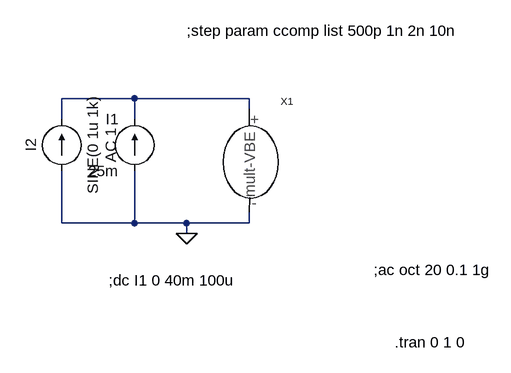
[diagram p0: schematic mult-vbe.asc]
mult-vbe.asc, the LTspice schematic file:
Version 4
SHEET 1 880 680
WIRE -80 32 -192 32
WIRE 96 32 -80 32
WIRE 96 48 96 32
WIRE -192 64 -192 32
WIRE -80 64 -80 32
WIRE -192 224 -192 144
WIRE -80 224 -80 144
WIRE -80 224 -192 224
WIRE 0 224 -80 224
WIRE 96 224 96 208
WIRE 96 224 0 224
WIRE 0 240 0 224
FLAG 0 240 0
SYMBOL current -80 144 R180
WINDOW 0 24 80 Left 2
WINDOW 3 24 0 Left 2
WINDOW 123 0 0 Left 2
WINDOW 39 0 0 Left 2
SYMATTR InstName I1
SYMATTR Value 25m
SYMBOL ss-mult-vbe 96 112 R0
SYMATTR InstName X1
SYMBOL current -192 144 R180
WINDOW 0 32 40 VTop 2
WINDOW 3 -32 40 VBottom 2
WINDOW 123 -60 40 VBottom 2
WINDOW 39 0 0 Left 2
SYMATTR InstName I2
SYMATTR Value SINE(0 1u 1k)
SYMATTR Value2 AC 1
TEXT -120 312 Left 2 !;dc I1 0 40m 100u
TEXT 288 296 Left 2 !;ac oct 20 0.1 1g
TEXT 0 -72 Left 2 !;step param ccomp list 500p 1n 2n 10n
TEXT 320 408 Left 2 !.tran 0 1 0

The netlist it stands for:
* mult-vbe.asc
I1 0 N001 25m
XX1 N001 0 ss-mult-vbe  ; pins +mvbe -mvbe
I2 0 N001 SINE(0 1u 1k) AC 1
;dc I1 0 40m 100u
;ac oct 20 0.1 1g
;step param ccomp list 500p 1n 2n 10n
.tran 0 1 0
.backanno
.end